# EAGLE design OfficeSign (EAGLE 8.7.1)
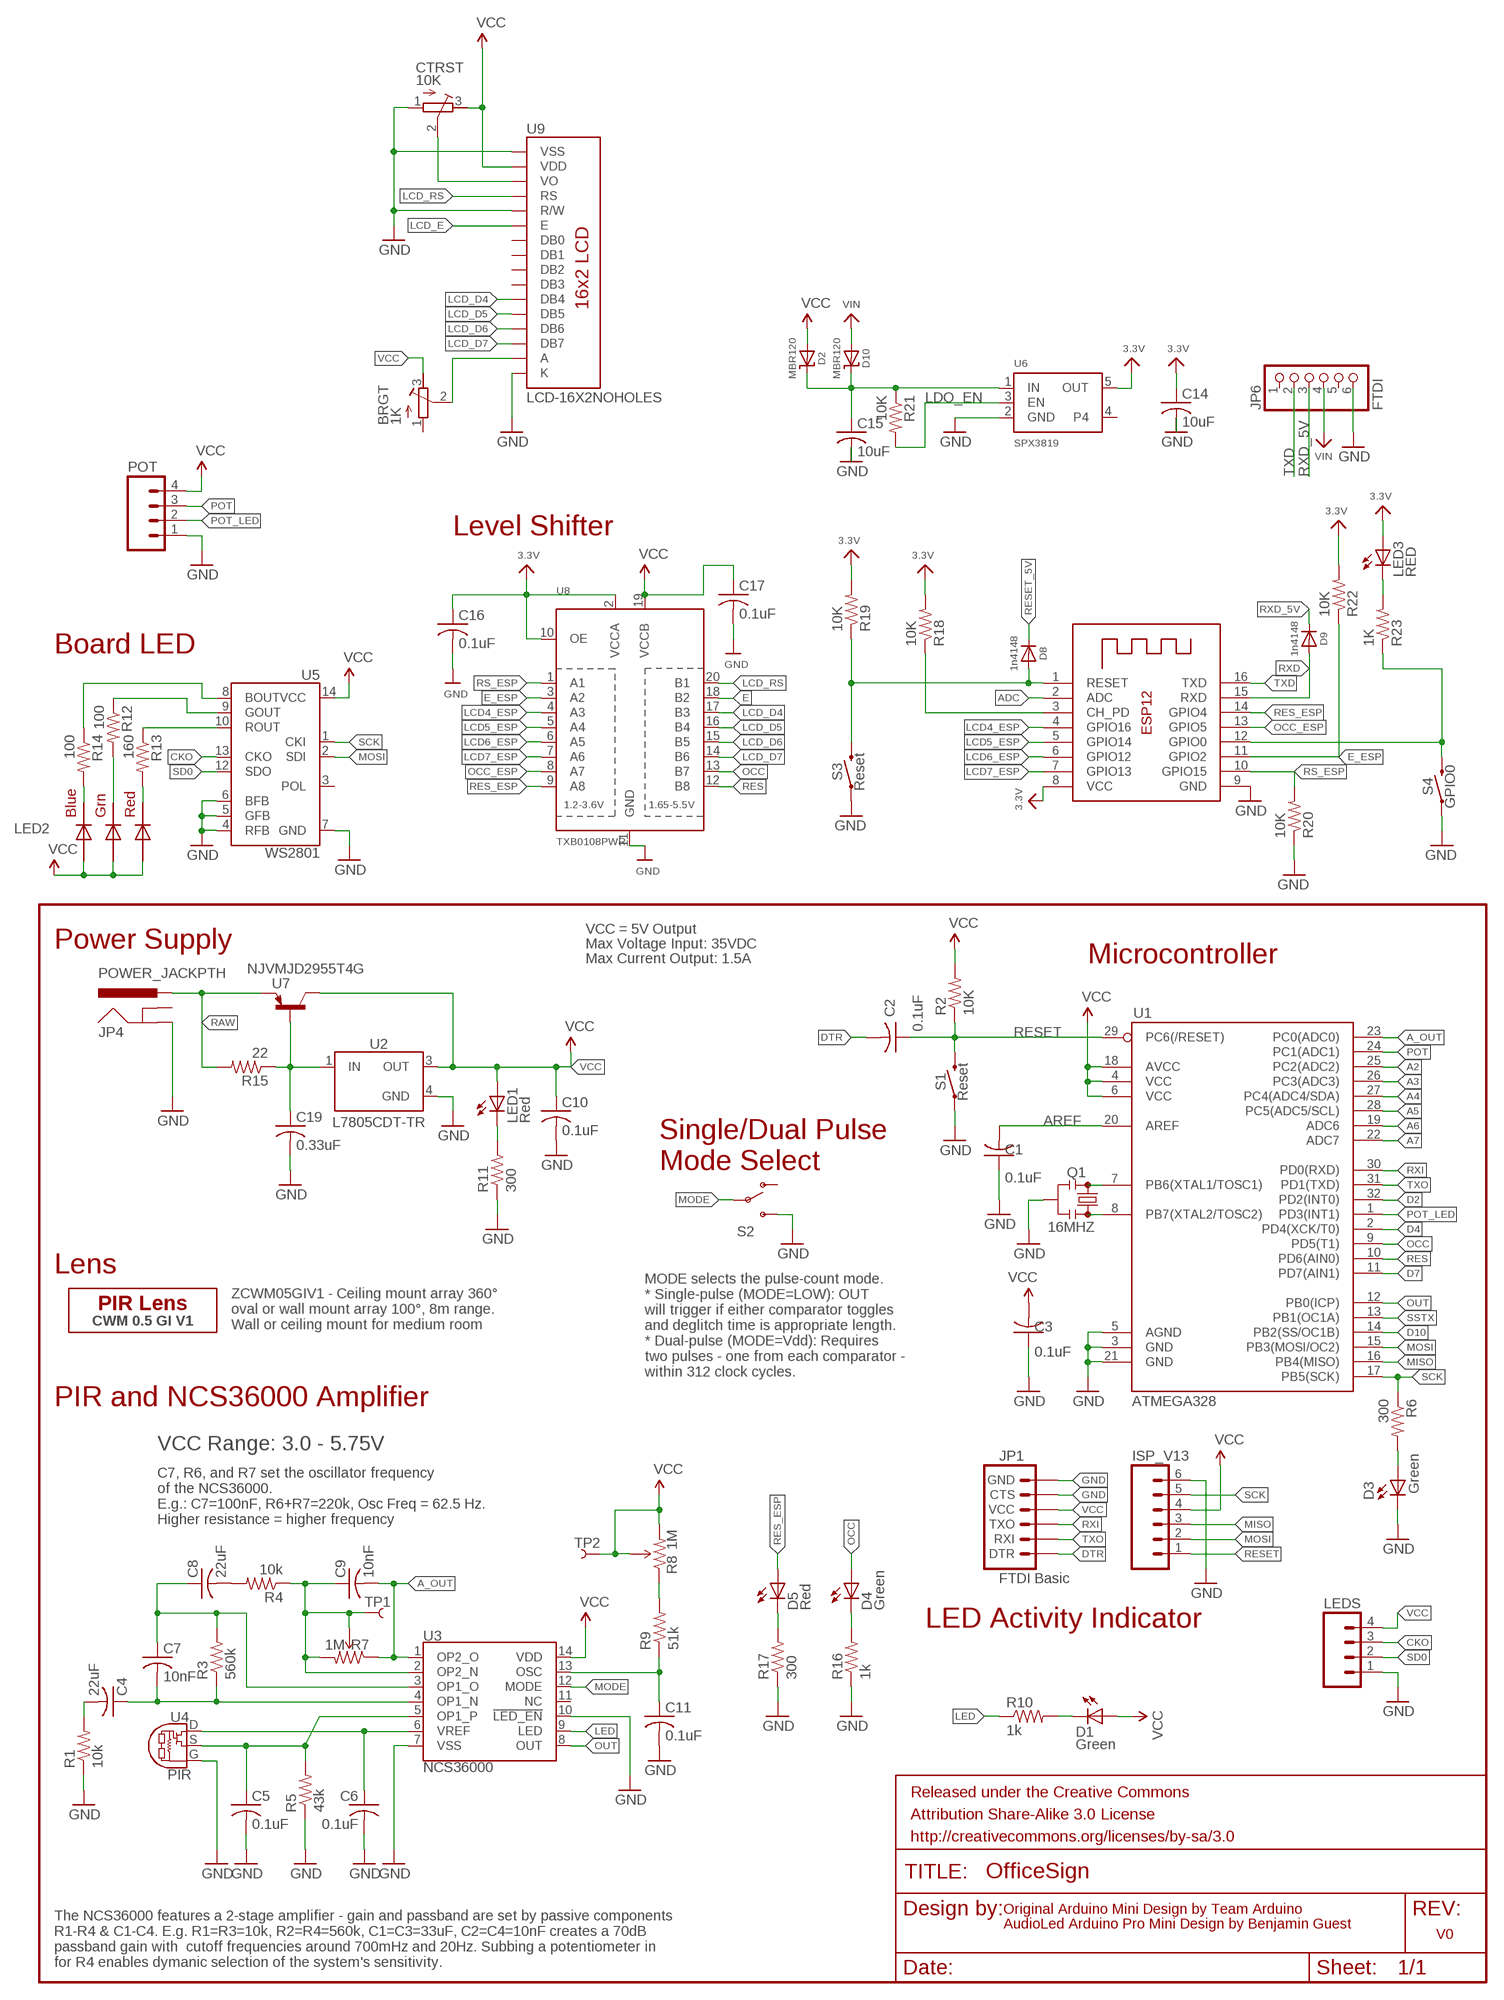
[diagram p0: schematic, sheet 1]

## Parts
BRGT  1K  R-TRIMM3296W  [RTRIM3296W]
C1  0.1uF  C-USC0805  [C0805]
C2  0.1uF  C-USC0805  [C0805]
C3  0.1uF  C-USC0805  [C0805]
C4  22uF  C-USC0805  [C0805]
C5  0.1uF  C-USC0805  [C0805]
C6  0.1uF  C-USC0805  [C0805]
C7  10nF  C-USC0805  [C0805]
C8  22uF  C-USC0805  [C0805]
C9  10nF  C-USC0805  [C0805]
C10  0.1uF  C-USC0805  [C0805]
C11  0.1uF  C-USC0805  [C0805]
C14  10uF  C-USC0805  [C0805]
C15  10uF  C-USC0805  [C0805]
C16  0.1uF  C-USC0805  [C0805]
C17  0.1uF  C-USC0805  [C0805]
C19  0.33uF  C-USC0805  [C0805]
CTRST  10K  R-TRIMM3296W  [RTRIM3296W]
D1  Green  LEDCHIPLED_0805  [CHIPLED_0805]
D2  MBR120  DIODE-SCHOTTKYSOD-123  [SOD-123]
D3  Green  LEDCHIPLED_0805  [CHIPLED_0805]
D4  Green  LEDCHIPLED_0805  [CHIPLED_0805]
D5  Red  LEDCHIPLED_0805  [CHIPLED_0805]
D8  1n4148  DIODESOD-323  [SOD-323]
D9  1n4148  DIODESOD-323  [SOD-323]
D10  MBR120  DIODE-SCHOTTKYSOD-123  [SOD-123]
FRAME1  FRAME-LETTER  [CREATIVE_COMMONS]
ISP_V13  M06SIP  [1X06]
JP1  FTDI Basic  ARDUINO_SERIAL_PROGRAMPTH  [1X06]
JP4  POWER_JACKPTH  [POWER_JACK_PTH]
JP6  FTDI  HEADER-1X670MIL  [1X06_ROUND_70]
LED1  Red  LEDCHIPLED_0805  [CHIPLED_0805]
LED2  RGBLED5050  [RGBLED5050]
LED3  RED  LEDCHIP-LED0805  [CHIP-LED0805]
LEDS  M04JST-PTH  [JST-4-PTH]
POT  M04JST-PTH  [JST-4-PTH]
Q1  16MHZ  RESONATOR16MHZ  [RESONATOR-SMD]
R1  10k  R-US_M0805  [M0805]
R2  10K  R-US_M0805  [M0805]
R3  560k  R-US_M0805  [M0805]
R4  10k  R-US_M0805  [M0805]
R5  43k  R-US_M0805  [M0805]
R6  300  R-US_M0805  [M0805]
R7  1M  TRIMPOTTX33X-1M  [TRIMPOT-TC33X]
R8  1M  TRIMPOTTX33X-1M  [TRIMPOT-TC33X]
R9  51k  R-US_M0805  [M0805]
R10  1k  R-US_M0805  [M0805]
R11  300  R-US_M0805  [M0805]
R12  100  R-US_M0805  [M0805]
R13  160  R-US_M0805  [M0805]
R14  100  R-US_M0805  [M0805]
R15  22  R-US_M0805  [M0805]
R16  1k  R-US_M0805  [M0805]
R17  300  R-US_M0805  [M0805]
R18  10K  R-US_M0805  [M0805]
R19  10K  R-US_M0805  [M0805]
R20  10K  R-US_M0805  [M0805]
R21  10K  R-US_M0805  [M0805]
R22  10K  R-US_M0805  [M0805]
R23  1K  R-US_M0805  [M0805]
S1  Reset  MOMENTARY-SWITCH-SPST-SMD-5.2-REDUNDANT  [TACTILE_SWITCH_SMD_5.2MM]
S2  SWITCH-SPDT-SMD-A  [SWITCH-SPST-SMD-A]
S3  Reset  MOMENTARY-SWITCH-SPST-SMD-5.2-REDUNDANT  [TACTILE_SWITCH_SMD_5.2MM]
S4  GPIO0  MOMENTARY-SWITCH-SPST-SMD-5.2-REDUNDANT  [TACTILE_SWITCH_SMD_5.2MM]
TP1  TEST-POINT3X5  [PAD.03X.05]
TP2  TEST-POINT3X5  [PAD.03X.05]
U1  ATMEGA328  ATMEGA168  [TQFP32-08]
U2  L7805CDT-TR  [DPAK]
U3  NCS36000  [SO14]
U4  PIR  [PIR]
U5  WS2801  [SOP-14]
U6  SPX3819  VREG_SOT23-5  [SOT23-5]
U7  NJVMJD2955T4G  [DPAK]
U8  TXB0108PWR  [TSSOP20]
U9  LCD-16X2NOHOLES  [LCD-16X2_NOHOLES]
U$1  CWM 0.5 GI V1  PIR-LENSCWM-0.5-GI-V1  [LENS-CWM-0.5-GI-V1]
X2  ESP-12  [ESP-12]

## Nets
3.3V: C14.1 C16.1 LED3.A R18.2 R19.2 R22.2 U6.5(OUT) U8.2(VCCA) U8.10(OE) X2.8(VCC)
A1: BRGT.2(S) U9.15(A)
A2: U1.25(PC2(ADC2))
A3: U1.26(PC3(ADC3))
A4: U1.27(PC4(ADC4/SDA))
A5: U1.28(PC5(ADC5/SCL))
A6: U1.19(ADC6)
A7: U1.22(ADC7)
A_OUT: C9.2 R7.1(CCW) U1.23(PC0(ADC0)) U3.1(OP2_O)
ADC: X2.2(ADC)
AREF: C1.2 U1.20(AREF)
CH_PD: R18.1 X2.3(CH_PD)
CKO: LEDS.3 U5.13(CKO)
D2: U1.32(PD2(INT0))
D4: U1.2(PD4(XCK/T0))
D7: U1.11(PD7(AIN1))
D10: U1.14(PB2(SS/OC1B))
DTR: C2.2 JP1.1(DTR)
E: U8.18(B2)
E_ESP: R22.1 U8.3(A2) X2.11(GPIO2)
GND [vcc]: C1.1 C3.1 C5.2 C6.2 C10.2 C11.2 C14.2 C15.2 C16.2 C17.2 C19.2 CTRST.1(A) D3.C ISP_V13.6 JP1.5(CTS) JP1.6(GND) JP4.GND JP6.6 LEDS.1 POT.1 Q1.2 R1.1 R5.1 R11.1 R16.1 R17.1 R20.1 S1.1 S1.2 S2.3(S) S3.1 S3.2 S4.1 S4.2 U1.3(GND) U1.5(AGND) U1.21(GND) U2.4(GND) U3.7(VSS) U3.10(!LED_EN!) U4.G U5.4(RFB) U5.5(GFB) U5.6(BFB) U5.7(GND) U6.2(GND) U8.11(GND) U9.1(VSS) U9.5(R/W) U9.16(K) X2.9(GND)
GPIO0: R23.1 S4.3 S4.4 X2.12(GPIO0)
L7805_IN [vcc]: C19.1 R15.1 U2.1(IN) U7.1(B)
LCD4_ESP: U8.4(A3) X2.4(GPIO16)
LCD5_ESP: U8.5(A4) X2.5(GPIO14)
LCD6_ESP: U8.6(A5) X2.6(GPIO12)
LCD7_ESP: U8.7(A6) X2.7(GPIO13)
LCD_D4: U8.17(B3) U9.11(DB4)
LCD_D5: U8.16(B4) U9.12(DB5)
LCD_D6: U8.15(B5) U9.13(DB6)
LCD_D7: U8.14(B6) U9.14(DB7)
LCD_E: U9.6(E)
LCD_RS: U8.20(B1) U9.4(RS)
LDO_EN: R21.2 U6.3(EN)
LED: R10.1 U3.9(LED)
MISO: ISP_V13.3 U1.16(PB4(MISO))
MODE: S2.2(P) U3.12(MODE)
MOSI: ISP_V13.2 U1.15(PB3(MOSI/OC2)) U5.2(SDI)
N$1: Q1.3 U1.8(PB7(XTAL2/TOSC2))
N$2: Q1.1 U1.7(PB6(XTAL1/TOSC1))
N$3: C6.1 U3.6(VREF) U4.D
N$4: LED1.C R11.2
N$5: C5.1 R5.2 U3.5(OP1_P) U4.S
N$6: C4.2 R1.2
N$7: D3.A R6.2
N$8: C8.2 R4.2
N$9: C4.1 C7.2 R3.1 U3.4(OP1_N)
N$10: C7.1 C8.1 R3.2 U3.3(OP1_O)
N$11: C9.1 R4.1 R7.2(WIPER) R7.3(CW) TP1.P$1 U3.2(OP2_N)
N$12: C11.1 R9.1 U3.13(OSC)
N$13: R8.1(CCW) R9.2
N$14: D1.C R10.2
N$15: R14.1 U5.8(BOUT)
N$16: R13.1 U5.10(ROUT)
N$17: LED3.C R23.2
N$18: D5.C R17.2
N$19: R12.1 U5.9(GOUT)
N$20: LED2.4(BLUE_C) R14.2
N$21: LED2.6(GREEN_C) R12.2
N$22: LED2.5(RED_C) R13.2
N$23: C15.1 D2.C D10.C R21.1 U6.1(IN)
N$24: D4.C R16.2
OCC: D4.A U1.9(PD5(T1)) U8.13(B7)
OCC_ESP: U8.8(A7) X2.13(GPIO5)
OUT: U1.12(PB0(ICP)) U3.8(OUT)
POT: POT.3 U1.24(PC1(ADC1))
POT_LED: POT.2 U1.1(PD3(INT1))
RAW [vcc]: JP4.PWR R15.2 U7.3(E)
RES: U1.10(PD6(AIN0)) U8.12(B8)
RES_ESP: D5.A U8.9(A8) X2.14(GPIO4)
RESET: C2.1 ISP_V13.1 R2.1 S1.3 S1.4 U1.29(PC6(/RESET))
RESET_5V: D8.C
RESET_HZA: D8.A R19.1 S3.3 S3.4 X2.1(RESET)
RS_ESP: R20.2 U8.1(A1) X2.10(GPIO15)
RXD: D9.A X2.15(RXD)
RXD_5V: D9.C JP6.3
RXI: JP1.3(TXO) U1.30(PD0(RXD))
SCK: ISP_V13.5 R6.1 U1.17(PB5(SCK)) U5.1(CKI)
SD0: LEDS.2 U5.12(SDO)
SSTX: U1.13(PB1(OC1A))
TXD: JP6.2 X2.16(TXD)
TXO: JP1.2(RXI) U1.31(PD1(TXD))
VCC [raw]: BRGT.3(E) C3.2 C10.1 C17.1 CTRST.3(E) D1.A D2.A ISP_V13.4 JP1.4(VCC) LED1.A LED2.1(GREEN_A) LED2.2(RED_A) LED2.3(BLUE_A) LEDS.4 POT.4 R2.2 R8.2(WIPER) R8.3(CW) TP2.P$1 U1.4(VCC) U1.6(VCC) U1.18(AVCC) U2.3(OUT) U3.14(VDD) U5.14(VCC) U7.4(C) U8.19(VCCB) U9.2(VDD)
VIN: D10.A JP6.4
VO: CTRST.2(S) U9.3(VO)
Unconnected: BRGT.1(A) JP4.GNDBREAK JP6.1 JP6.5 S2.1(O) U3.11(NC) U5.3(POL) U6.4 U9.7(DB0) U9.8(DB1) U9.9(DB2) U9.10(DB3)

## Notes on the sheet
- Level Shifter
- Board LED
- VCC = 5V Output
- Power Supply | Max Voltage Input: 35VDC
- Max Current Output: 1.5A | Microcontroller
- Single/Dual Pulse
  Mode Select
- Lens
- ZCWM05GIV1 - Ceiling mount array 360°
  oval or wall mount array 100°, 8m range.
  Wall or ceiling mount for medium room
- MODE selects the pulse-count mode.
  * Single-pulse (MODE=LOW): OUT 
  will trigger if either comparator toggles
  and deglitch time is appropriate length.
  * Dual-pulse (MODE=Vdd): Requires 
  two pulses - one from each comparator -
  within 312 clock cycles.
- PIR and NCS36000 Amplifier
- VCC Range: 3.0 - 5.75V
- C7, R6, and R7 set the oscillator frequency 
  of the NCS36000.
  E.g.: C7=100nF, R6+R7=220k, Osc Freq = 62.5 Hz.
  Higher resistance = higher frequency
- LED Activity Indicator
- Original Arduino Mini Design by Team Arduino
- AudioLed Arduino Pro Mini Design by Benjamin Guest
- V0
- The NCS36000 features a 2-stage amplifier - gain and passband are set by passive components
  R1-R4 & C1-C4. E.g. R1=R3=10k, R2=R4=560k, C1=C3=33uF, C2=C4=10nF creates a 70dB
  passband gain with  cutoff frequencies around 700mHz and 20Hz. Subbing a potentiometer in
  for R4 enables dymanic selection of the system's sensitivity.

## Library data of the parts
BRGT CTRST = resistor:R-TRIMM: Trimm resistor
C1-C11 C14 C15 C19 = adafruit:C-US: CAPACITOR, American symbol
C16 C17 = rcl:C-US: CAPACITOR, American symbol; SPICEPREFIX: C
D1 D3-D5 LED1 LED3 = led:LED: LED OSRAM: - CHIPLED LG R971, LG N971, LY N971, LG Q971, LY Q971, LO R971, LY R971 LH N974, LH R974 LS Q976, LO Q976, LY Q976 LO Q996 - Hyper CHIPLED LW Q18S LB Q993, LB Q99A, LB R99A - SideLED LS A670, LO A670, LY A670, LG A670, LP A670 LB A673, LV A673, LT A673, LW A673 LH A674 LY A675 LS A676, LA A676, LO A676, LY A676, LW A676 LS A679, LY A679, LG A679 - Hyper Micro SIDELED® LS Y876, LA Y876, LO Y876, LY Y876 LT Y87S - SmartLED LW L88C, LW L88S LB L89C, LB L89S, LG L890 LS L89K, LO L89K, LY L89K LS L896, LA L896, LO L896, LY L896 - TOPLED LS T670, LO T670, LY T670, LG T670, LP T670 LSG T670, LSP T670, LSY T670, LOP T670, LYG T670 LG T671, LOG T671, LSG T671 LB T673, LV T673, LT T673, LW T673 LH T674 LS T676, LA T676, LO T676, LY T676, LB T676, LH T676, LSB T676, LW T676 LB T67C, LV T67C, LT T67C, LS T67K, LO T67K, LY T67K, LW E67C LS E67B, LA E67B, LO E67B, LY E67B, LB E67C, LV E67C, LT E67C LW T67C LS T679, LY T679, LG T679 LS T770, LO T770, LY T770, LG T770, LP T770 LB T773, LV T773, LT T773, LW T773 LH T774 LS E675, LA E675, LY E675, LS T675 LS T776, LA T776, LO T776, LY T776, LB T776 LHGB T686 LT T68C, LB T68C - Hyper Mini TOPLED® LB M676 - Mini TOPLED Santana® LG M470 LS M47K, LO M47K, LY M47K Source: http://www.osram.convergy.de LUXEON: - LUMILED® LXK2-PW12-R00, LXK2-PW12-S00, LXK2-PW14-U00, LXK2-PW14-V00 LXK2-PM12-R00, LXK2-PM12-S00, LXK2-PM14-U00 LXK2-PE12-Q00, LXK2-PE12-R00, LXK2-PE12-S00, LXK2-PE14-T00, LXK2-PE14-U00 LXK2-PB12-K00, LXK2-PB12-L00, LXK2-PB12-M00, LXK2-PB14-N00, LXK2-PB14-P00, LXK2-PB14-Q00 LXK2-PR12-L00, LXK2-PR12-M00, LXK2-PR14-Q00, LXK2-PR14-R00 LXK2-PD12-Q00, LXK2-PD12-R00, LXK2-PD12-S00 LXK2-PH12-R00, LXK2-PH12-S00 LXK2-PL12-P00, LXK2-PL12-Q00, LXK2-PL12-R00 Source: www.luxeon.com KINGBRIGHT: KA-3528ASYC Source: www.kingbright.com
D2 D10 = microbuilder:DIODE-SCHOTTKY
D8 D9 = microbuilder:DIODE: Diode SMA Model Volts Amps Type Vf Ir Digikey # Notes SSA34-E3 40V 3A Schottky 480mV @ 3A 200uA @ 40V SSA34-E3/61TGITR-ND CDBA120-G 20V 1A Schottky 500mV @ 1A 500uA @ 20V 641-1014-6-ND REEL MBRA210 10V 2A Schottky 350mV @ 2A 700uA @ 10V MBRA210LT3 SOD-123 Model Volts Amps Type Vf Ir Order # Notes BAT54T1G 30V 200mA Schottky 800mV @ 200mA 2uA @ 25V BAT54T1GOSTR-ND B0530W 30V 500mA Schottky 430mV @ 500mA 130uA @ 30V B0530W-FDICT-ND REEL MBR120 20V 1A Schottky 340mV @ 1A MBR120VLSFT1GOSCT-ND SOD-323 Model Volts Amps Type Vf Ir Order # Notes PMEG2005EJ 20V 500mA Schottky 355mV @ 500mA 568-4110-1-ND ZLLS410 10V 570mA Schottky 380mV @ 570mA ZLLS410CT-ND 1N4148WS 75V 150mA Silicon/Simple 1V 1N4148WSFSCT-ND REEL SOD-523 Model Volts Amps Type Vf Ir Order # Notes BAT54XV2 30V 200mA Schottky 0.8V @ 100mA BAT54XV2CT-ND TB751S 30V 30mA Schottky RB751S-40TE61CT-ND SOT23-R/W (R = Solder Paste/Reflow Ovens, W = Hand-Soldering) Model Volts Amps Type Vf Ir Order # Notes BAT54FILM 40V 300mA Schottky 497-7162-1-ND POWERDI-5 Model Volts Amps Type Vf Ir Order # Notes PDS560 60V 5A Schottky 670mV @ 5A 150uA @ 60V PDS560DICT-ND
FRAME1 = SparkFun-Aesthetics:FRAME-LETTER: Schematic Frame Standard 8.5x11 US Letter frame
ISP_V13 = SparkFun-Connectors:M06: Header 6 Standard 6-pin 0.1" header. Use with straight break away headers (SKU : PRT-00116), right angle break away headers (PRT-00553), swiss pins (PRT-00743), machine pins (PRT-00117), and female headers (PRT-00115). Molex polarized connector foot print use with SKU : PRT-08094 with associated crimp pins and housings. NOTES ON THE VARIANTS LOCK and LOCK_LONGPADS... This footprint was designed to help hold the alignment of a through-hole component (i.e. 6-pin header) while soldering it into place. You may notice that each hole has been shifted either up or down by 0.005 of an inch from it's more standard position (which is a perfectly straight line). This slight alteration caused the pins (the squares in the middle) to touch the edges of the holes. Because they are alternating, it causes a "brace" to hold the component in place. 0.005 has proven to be the perfect amount of "off-center" position when using our standard breakaway headers. Although looks a little odd when you look at the bare footprint, once you have a header in there, the alteration is very hard to notice. Also, if you push a header all the way into place, it is covered up entirely on the bottom side. This idea of altering the position of holes to aid alignment will be further integrated into the Sparkfun Library for other footprints. It can help hold any component with 3 or more connection pins.
JP1 = SparkFun:ARDUINO_SERIAL_PROGRAM
JP4 = SparkFun-Connectors:POWER_JACK: Power Jack This is the standard 5.5mm barrel jack for power. The PTH is the most common, proven, reliable, footprint. The Slot footprint only works if the mill layer is transmitted to the PCB fab house so be warned. Mating wall wart : TOL-00298 (and others); PROD_ID: CONN-08197
JP6 = microbuilder:HEADER-1X6: PIN HEADER
LED2 = adafruit:RGBLED: For 5050 RGB LEDs, the order of the LEDs may vary from one manufacturer to another!
LEDS POT = SparkFun-Connectors:M04: Header 4 Standard 4-pin 0.1" header. Use with straight break away headers (SKU : PRT-00116), right angle break away headers (PRT-00553), swiss pins (PRT-00743), machine pins (PRT-00117), and female headers (PRT-00115). Molex polarized connector foot print use with SKU : PRT-08231 with associated crimp pins and housings. 1MM SMD Version SKU: PRT-10208; SKU: PRT-09916
Q1 = SparkFun-FreqCtrl:RESONATOR: Resonator Small SMD resonator. Used, eg, on the Arduino Pro/ Pro Mini boards. 8MHz- XTAL-08895 16MHz- XTAL-08900; PROD_ID: XTAL-08900
R1-R6 R9-R23 = adafruit:R-US_: RESISTOR, American symbol
R7 R8 = openPIR-temp:TRIMPOT: Various small potentiometers for "set-and-forget" applications; PROD_ID: RES-13431
S1 S3 S4 = SparkFun-Switches:MOMENTARY-SWITCH-SPST: Momentary Switch (Pushbutton) - SPST Normally-open (NO) SPST momentary switches (buttons, pushbuttons). Variants PTH-12MM - 12mm square, through-hole Momentary Pushbutton Switch - 12mm Square <https://www.sparkfun.com/products/9190> (COM-09190) PTH-6.0MM, PTH-6.0MM-KIT - 6.0mm square, through-hole Mini Pushbutton Switch <https://www.sparkfun.com/products/97> (COM-00097) KIT package intended for soldering kit's - only one side of pads' copper is exposed. PTH-RIGHT-ANGLE-KIT - Right-angle, through-hole Right Angle Tactile Button <https://www.sparkfun.com/products/10791> - Used on SparkFun BigTime Watch Kit <https://www.sparkfun.com/products/11734> SMD-12MM - 12mm square, surface-mount Tactile Button - SMD (12mm) <https://www.sparkfun.com/products/12993> (COM-12993) Used on SparkFun PicoBoard <https://www.sparkfun.com/products/11888> SMD-4.5MM - 4.5mm Square Trackball Switch Used on SparkFun Blackberry Trackballer Breakout <https://www.sparkfun.com/products/13169> SMD-4.6MMX2.8MM - 4.60mm x 2.80mm, surface mount Used on SparkFun SAMD21 Mini Breakout <https://www.sparkfun.com/products/13664> SMD-5.2MM, SMD-5.2-REDUNDANT - 5.2mm square, surface-mount Mini Pushbutton Switch - SMD <https://www.sparkfun.com/products/8720> (COM-08720) Used on Arduino Pro Mini <https://www.sparkfun.com/products/11114> REDUNDANT package connects both switch circuits together SMD-6.0X3.5MM - 6.0 x 3.5mm, surface mount Momentary Reset Switch SMD <https://www.sparkfun.com/products/8229> (COM-08229) SMD-6.2MM-TALL - 6.2mm square, surface mount Tactile Button - SMD (6mm) <https://www.sparkfun.com/products/12992> Used on SparkFun Digital Sandbox <https://www.sparkfun.com/products/12651> SMD-RIGHT-ANGLE - Right-angle, surface mount Used on SparkFun Block for Intel® Edison - Arduino <https://www.sparkfun.com/products/13036>; PROD_ID: SWCH-08247; SF_SKU: COM-08720
S2 = SparkFun-Electromechanical:SWITCH-SPDT: SPDT Switch Simple slide switch, Spark Fun Electronics SKU : COM-00102 DPDT SMT slide switch, AYZ0202, SWCH-08179; PROD_ID: SWCH-10651
TP1 TP2 = SparkFun-Connectors:TEST-POINT: Bare copper test points for troubleshooting or ICT
U1 = SparkFun:ATMEGA168
U2 = BAG:L7805CDT-TR: Description The L78 series of three-terminal positive regulators is available in TO-220, TO-220FP, D²PAK and DPAK packages and several fixed output voltages, making it useful in a wide range of applications. These regulators can provide local on-card regulation, eliminating the distribution problems associated with single point regulation. Each type embeds internal current limiting, thermal shutdown and safe area protection, making it essentially indestructible. If adequate heat sinking is provided, they can deliver over 1 A output current. Although designed primarily as fixed voltage regulators, these devices can be used with external components to obtain adjustable voltage and currents.
U3 = openPIR-temp:NCS36000; PROD_ID: IC-13432
U4 = openPIR-temp:PIR; PROD_ID: IC-13430
U5 = SparkFun-DigitalIC:WS2801: WS2801 3 Channel Constant Current LED Driver with programmable PWM outputs. Datasheet: http://www.sparkfun.com/datasheets/Components/LED/WS2801.pdf
U6 = microbuilder:VREG_SOT23-5: SOT23-5 Fixed Voltage Regulators Part Current Out V Out V In V Dropout θJA (°C/W) TJ (°C) Digikey Part No. ADP121 150mA 3.3V 3.4-5.5V 0.09V @ 150mA -- -- ADP121-AUJZ33R7CT-ND ADP121 150mA 3.0V 3.1-5.5V 0.09V @ 150mA -- -- ADP121-AUJZ30R7CT-ND ADP122 300mA 3.3V 3.4-5.5V 0.085V @ 300mA -- -- ADP122AUJZ-3.3-R7CT-ND ADP1712 300mA 3.3V 3.5-5.5V 0.17V @ 300mA -- -- ADP1712AUJZ-3.3-R7TR-ND AP7311 (Low Cost) 150mA 3.3V 3.5-6V 0.15V @ 150mA -- -- AP7311-33WG-7DICT-ND LD39015M18R 150mA 1.8V 1.9V-5.5V 0.08V @ 100mA -- -- 497-6977-1-ND LP2985A-33DBVR 150mA 3.3V 3.3-16V 0.28V @ 150mA 206 150 296-18479-1-ND MCP1824T-3302E/OT 300mA 3.3V 3.5V-6V 0.2V @ 300mA -- -- MCP1824T-3302E/OTCT-ND MIC5205-2.5YM5 TR 150mA 2.5V 2.7-16V 0.165V @ 150mA -- -- 576-1257-2-ND MIC5205-3.0YM5 TR 150mA 3.0V 3.2V-16V 0.165V @ 150mA -- -- 576-1258-2-ND MIC5205-3.3YM5 TR 150mA 3.3V 3.5V-16V 0.165V @ 150mA -- -- 576-1259-2-ND TPS780330220 150mA 3.3V+2.2V 3.6-5.5V 250mV Max -- -- 296-23332-1-ND TDA3663/N1,135 100mA 3.3V 3.5-45V 0.18V @ 50mA -- -- 568-5343-1-ND Max operating temp can be calculated using θJA, TJ (max junction temperature), and power in watts. Set the "Maximum Ambient Temperature" until it reaches TJ ("Max Junction Temperature"), which is the absolute limit for safe use of the regulator: Heat Sink Temperature Calculator <http://www.daycounter.com/Calculators/Heat-Sink-Temperature-Calculator.phtml> For example, With 12V source into a 3.3V LP2985 and a 30mA load, we are dissipating (12V-3.3V) * 0.03A = 0.261W. With a θJA of 206 °C/W, a TJ of 150°C, and 261mW we can safely use the chip without a heat sink up to 75°C (=147.1°C Junction Temperature).
U7 = bg_eagle_lib:NJVMJD2955T4G
U8 = microbuilder:TXB0108PWR: 8-Bit Bi-Directional Level Shifter 1.2V-3.6V (VCCA) to 1.65V-5.5V (VCCB) bi-directional level shifter with auto direction sensing. Max data rate - VCCA 1.8V: 20Mbps (50ns), VCCA 3.3V: 100Mbps (10ns) Digikey: 296-21527-1-ND
U9 = SparkFun-Displays:LCD-16X2: Standard text-only 16x2 parallel input LCD
U$1 = openPIR-temp:PIR-LENS
X2 = microbuilder:ESP-12

## Net classes
0 default: width 0.254 mm, drill 0.381 mm, clearance 0.254 mm
1 vcc: width 0.508 mm, drill 0.381 mm, clearance 0.254 mm
2 raw: width 0.508 mm, drill 0.381 mm, clearance 0.254 mm

## Board
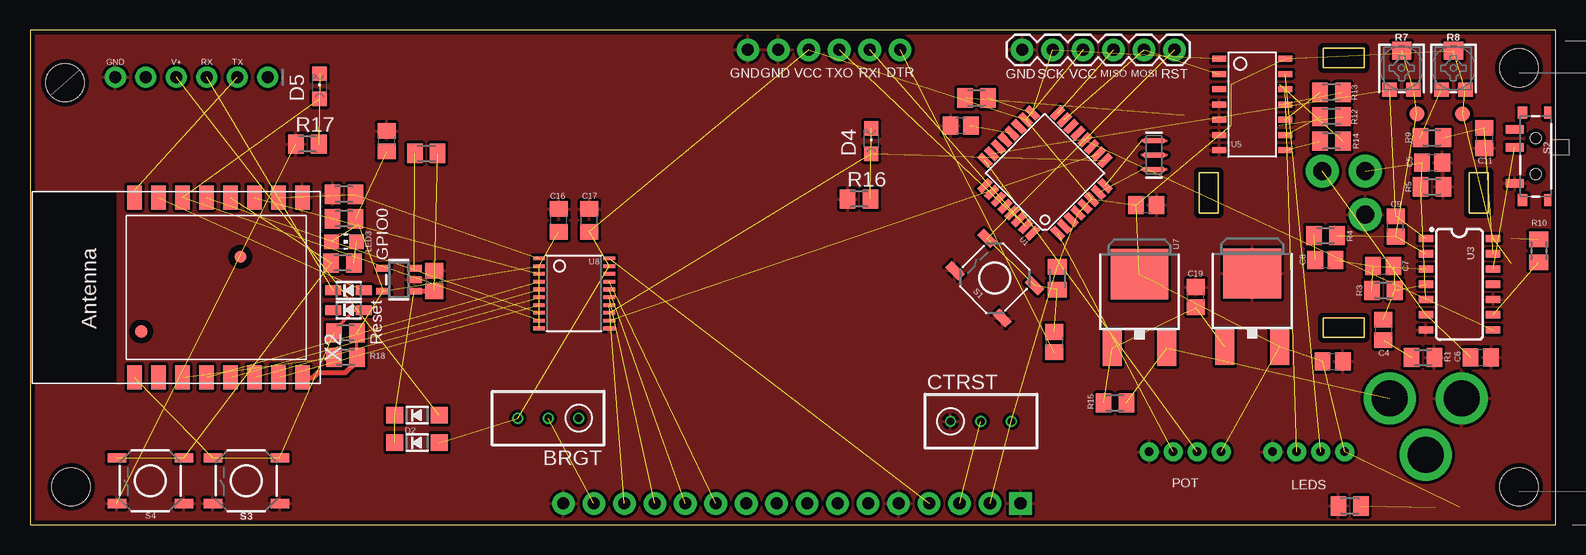
[diagram p1: board, top side]
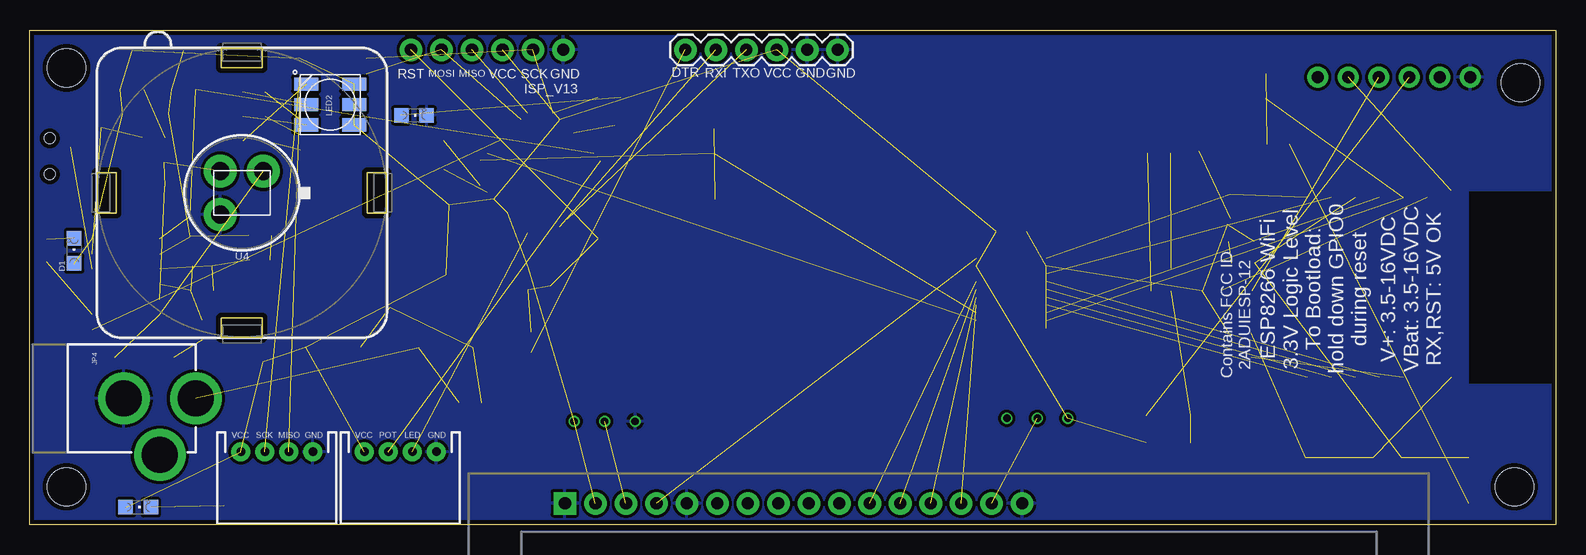
[diagram p2: board, bottom side, seen from below]

Size 127.13 x 41.27 mm. Coordinates in mm from the lower left corner, seen from the top.
Outline: 7.87,0 28.19,0
Outline: 0,41.27 0,0 127.13,0 127.13,41.27 0,41.27
Copper layers (1*16): Top 0.035559375mm / dielectric 1.6mm / Bottom 0.035559375mm
Design rules "oshpark-2layer-auto-routing": minimum track width 10mil, minimum drill 10mil, track to track 10mil, track to pad 8mil, pad to pad 8mil, via to via 8mil, smd to smd 6mil, copper to edge 15mil, drill to drill 6mil, minimum pad ring 6mil, minimum via ring 6mil, stop-mask expansion 2.5mil, vias tented up to drill 0mil, thermal gap 10mil
Holes 3.17 mm at 124.08,3.17 3.43,3.17 2.92,36.88 124.08,38.1

### Footprints (pad centres in the part's own frame; a part is rotated, then mirrored left to right if it is on the bottom)
RTRIM3296W = drill 0.61: 1 0,-2.54; 2 0,0; 3 0,2.54
C0805 = smd 1.3 x 1.5: 1 -0.85,0; 2 0.85,0
C0805' = smd 1.3 x 1.5: 1 -0.95,0; 2 0.95,0
CHIPLED_0805 = smd 1.2 x 1.2: A 0,-1.05; C 0,1.05
SOD-123 = smd 1.4 x 1.4: A 1.85,0; C -1.85,0
SOD-323 = smd 1.35 x 0.8: A 1.27,0; C -1.27,0
FIDUCIAL_1MM = smd 1 x 1: 1 0,0
1X06 = drill 1.016 pad 1.88: 1 0,0; 2 2.54,0; 3 5.08,0; 4 7.62,0; 5 10.16,0; 6 12.7,0
POWER_JACK_PTH = drill 2.997 pad 4.318: GND 0,7.7; GNDBREAK 4.7,10.7; PWR 0,13.7
1X06_ROUND_70 = drill 1 pad 1.778: 1 -6.35,0; 2 -3.81,0; 3 -1.27,0; 4 1.27,0; 5 3.81,0; 6 6.35,0
RGBLED5050 = smd 2 x 1.1: 1 -2,1.7; 2 -2,0; 3 -2,-1.7; 4 2,-1.7; 5 2,0; 6 2,1.7
CHIP-LED0805 = smd 1.2 x 1.2: A 0,-1.05; C 0,1.05
JST-4-PTH = drill 0.7 pad 1.6: 1 -3,0; 2 -1,0; 3 1,0; 4 3,0
RESONATOR-SMD = smd 0.45 x 1.905: 1 -1.2,0; 2 0,0; 3 1.2,0
M0805 = smd 1.3 x 1.6: 1 -0.95,0; 2 0.95,0
TRIMPOT-TC33X = smd 1.2 x 1.2: 1 -1,-1.8; 3 1,-1.8 | smd 1.6 x 1.5: 2 0,1.45
TACTILE_SWITCH_SMD_5.2MM = smd 1.524 x 0.762: 1 -2.794,1.905; 2 2.794,1.905; 3 -2.794,-1.905; 4 2.794,-1.905
SWITCH-SPST-SMD-A = smd 0.7 x 1.5: 1 -2.25,-1.75; 2 -0.75,-1.75; 3 2.25,-1.75 | smd 1 x 0.6: GND1 -3.65,1; GND3 3.65,1 | smd 1 x 0.8: GND2 -3.65,-1.1; GND4 3.65,-1.1 | hole 0.9: -1.5,0; 1.5,0
PAD.03X.05 = smd 1.27 x 1.27: P$1 0,0
TQFP32-08 = smd 1.27 x 0.559: 1 -4.293,2.8; 2 -4.293,2; 3 -4.293,1.2; 4 -4.293,0.4; 5 -4.293,-0.4; 6 -4.293,-1.2; 7 -4.293,-2; 8 -4.293,-2.8; 17 4.293,-2.8; 18 4.293,-2; 19 4.293,-1.2; 20 4.293,-0.4; 21 4.293,0.4; 22 4.293,1.2; 23 4.293,2; 24 4.293,2.8 | smd 0.559 x 1.27: 9 -2.8,-4.293; 10 -2,-4.293; 11 -1.2,-4.293; 12 -0.4,-4.293; 13 0.4,-4.293; 14 1.2,-4.293; 15 2,-4.293; 16 2.8,-4.293; 25 2.8,4.293; 26 2,4.293; 27 1.2,4.293; 28 0.4,4.293; 29 -0.4,4.293; 30 -1.2,4.293; 31 -2,4.293; 32 -2.8,4.293
DPAK = smd 1.6 x 3: 1 -2.28,-4.04; 3 2.28,-4.04 | smd 4.826 x 4.191: 4 0,2.096
SO14 = smd 0.6 x 1.2: 1 -3.81,-2.8; 2 -2.54,-2.8; 3 -1.27,-2.8; 4 0,-2.8; 5 1.27,-2.8; 6 2.54,-2.8; 7 3.81,-2.8; 8 3.81,2.8; 9 2.54,2.8; 10 1.27,2.8; 11 0,2.8; 12 -1.27,2.8; 13 -2.54,2.8; 14 -3.81,2.8
PIR = drill 1.5 pad 2.75: D -1.8,-1.8; G 1.8,1.8; S 1.8,-1.8
SOP-14 = smd 0.5 x 1.2: 1 -3.81,-2.75; 2 -2.54,-2.75; 3 -1.27,-2.75; 4 0,-2.75; 5 1.27,-2.75; 6 2.54,-2.75; 7 3.81,-2.75; 8 3.81,2.75; 9 2.54,2.75; 10 1.27,2.75; 11 0,2.75; 12 -1.27,2.75; 13 -2.54,2.75; 14 -3.81,2.75
SOT23-5 = smd 0.55 x 1.2: 1 -0.95,-1.3; 2 0,-1.3; 3 0.95,-1.3; 4 0.95,1.3; 5 -0.95,1.3
TSSOP20 = smd 0.305 x 0.991: 1 -2.925,-2.918; 2 -2.275,-2.918; 3 -1.625,-2.918; 4 -0.975,-2.918; 5 -0.325,-2.918; 6 0.325,-2.918; 7 0.975,-2.918; 8 1.625,-2.918; 9 2.275,-2.918; 10 2.925,-2.918; 11 2.925,2.918; 12 2.275,2.918; 13 1.625,2.918; 14 0.975,2.918; 15 0.325,2.918; 16 -0.325,2.918; 17 -0.975,2.918; 18 -1.625,2.918; 19 -2.275,2.918; 20 -2.925,2.918
LCD-16X2_NOHOLES = drill 1.016 pad 1.88 square: 1 -32,15.5 | drill 1.016 pad 1.88: 2 -29.46,15.5; 3 -26.92,15.5; 4 -24.38,15.5; 5 -21.84,15.5; 6 -19.3,15.5; 7 -16.76,15.5; 8 -14.22,15.5; 9 -11.68,15.5; 10 -9.14,15.5; 11 -6.6,15.5; 12 -4.06,15.5; 13 -1.52,15.5; 14 1.02,15.5; 15 3.56,15.5; 16 6.1,15.5
ESP-12 = smd 2 x 1.2: 1 -7.5,4.5; 2 -7.5,2.5; 3 -7.5,0.5; 4 -7.5,-1.5; 5 -7.5,-3.5; 6 -7.5,-5.5; 7 -7.5,-7.5; 8 -7.5,-9.5; 9 7.5,-9.5; 10 7.5,-7.5; 11 7.5,-5.5; 12 7.5,-3.5; 13 7.5,-1.5; 14 7.5,0.5; 15 7.5,2.5; 16 7.5,4.5

### Placement (x,y rotation side)
BRGT  43.18,8.89 90 top
C1  77.56,33.31 0 top
C2  85.34,15.24 270 top
C3  93.03,26.67 180 top
C4  112.78,16.26 270 top
C5  116.84,30.23 0 top
C6  120.9,13.97 0 top
C7  112.78,21.59 0 top
C8  107.95,22.1 180 top
C9  113.79,24.89 90 top
C10  108.56,13.64 0 top
C11  121.18,32.27 270 top
C14  29.72,32 90 top
C15  33.71,20.35 90 top
C16  0.1uF  [C0805']  44.07,25.4 90 top
C17  0.1uF  [C0805']  46.61,25.4 90 top
C19  97.16,18.99 90 top
CTRST  79.25,8.64 270 top
D1  123.44,22.86 0 bottom
D2  32.26,6.86 0 top
D3  95.12,34.15 270 bottom
D4  70.1,32 0 top
D5  24.13,36.58 0 top
D8  26.54,17.91 0 top
D9  26.54,19.56 0 top
D10  32.26,9.14 0 top
FID2  FIDUCIAL""  [FIDUCIAL_1MM]  9.27,16.13 90 top
FID4  FIDUCIAL""  [FIDUCIAL_1MM]  17.53,22.35 90 top
FRAME1  48.53,-53.34 0 top  (outside the outline)
ISP_V13  95.38,39.62 180 top
JP1  72.52,39.62 0 bottom
JP4  127,10.54 270 bottom
JP6  13.46,37.34 180 top
LED1  118.11,1.47 270 bottom
LED2  102.11,35.05 180 bottom
LED3  26.16,23.62 270 top
LEDS  106.55,6.1 180 bottom
POT  96.27,6.1 180 bottom
Q1  93.68,30.84 90 top
R1  116.08,13.97 180 top
R2  85.6,20.57 90 top
R3  112.78,19.56 180 top
R4  107.95,24.13 180 top
R5  116.84,28.19 180 top
R6  78.87,35.61 180 top
R7  114.3,38.1 0 top
R8  118.62,38.1 0 top
R9  116.82,32.28 180 top
R10  125.73,22.86 90 top
R11  109.98,1.57 0 top
R12  108.46,34.04 0 top
R13  108.46,36.07 0 top
R14  108.46,32 0 top
R15  90.42,10.16 0 top
R16  69.09,27.18 0 top
R17  23.11,31.75 0 top
R18  26.29,13.97 0 top
R19  26.29,16 0 top
R20  26.16,27.56 0 top
R21  33.02,30.99 180 top
R22  26.16,25.53 0 top
R23  26.04,21.84 0 top
S1  80.39,20.57 135 top
S2  125.48,30.73 270 top
S3  18.03,3.68 180 top
S4  10.03,3.68 180 top
TP1  115.57,34.29 0 top
TP2  119.38,34.29 0 top
U1  84.58,29.34 135 top
U2  101.85,18.86 0 top
U3  119.13,20.07 270 top
U4  109.47,27.69 180 bottom
U5  101.85,35.05 270 top
U6  30.73,20.45 90 top
U7  92.46,18.8 0 top
U8  45.34,19.3 270 top
U9  50.55,-13.72 0 bottom
U$1  109.47,27.69 0 bottom
U$34  [HUZZAHLOGO]  7.75,28.7 270 bottom
X2  13.21,19.81 90 top

### Tracks (layer width: path | path; a pad name or v marks a point on that pad's centre or on a via)
3.3V  (7 unrouted)
  Top 0.254: 27.34,25.05 R22.2 | R19.2 R18.2 27.18,13.91
  Top 0.406: X2.8 23.62,12.31 24,12.7 26.29,12.7 27.05,13.46 27.05,13.78 R18.2
A1  (1 unrouted)
A_OUT  (3 unrouted)
AREF  (1 unrouted)
CH_PD  (1 unrouted)
CKO  (1 unrouted)
DTR  (1 unrouted)
E_ESP  (2 unrouted)
GND  (1 unrouted)
  pour Top: -0.25,41.66 -0.51,-0.25 127.38,-0.25 127.64,41.66
  pour Bottom: -0.51,42.16 -0.76,-0.51 127.64,-0.51 127.89,42.16
GPIO0  (3 unrouted)
L7805_IN  (3 unrouted)
LCD4_ESP  (1 unrouted)
LCD5_ESP  (1 unrouted)
  Top 0.305: 16.71,11.49 X2.5
LCD6_ESP  (1 unrouted)
  Top 0.305: 18.71,12.03 X2.6
LCD7_ESP  (1 unrouted)
LCD_D4  (1 unrouted)
LCD_D5  (1 unrouted)
LCD_D6  (1 unrouted)
LCD_D7  (1 unrouted)
LCD_RS  (1 unrouted)
LDO_EN  (1 unrouted)
LED  (1 unrouted)
MISO  (1 unrouted)
MODE  (1 unrouted)
MOSI  (2 unrouted)
N$1  (1 unrouted)
N$2  (1 unrouted)
N$3  (2 unrouted)
N$4  (1 unrouted)
N$5  (3 unrouted)
N$6  (1 unrouted)
N$7  (1 unrouted)
N$8  (1 unrouted)
N$9  (3 unrouted)
N$10  (3 unrouted)
N$11  (5 unrouted)
N$12  (2 unrouted)
N$13  (1 unrouted)
N$14  (1 unrouted)
N$15  (1 unrouted)
N$16  (1 unrouted)
N$17  (1 unrouted)
N$18  (1 unrouted)
N$19  (1 unrouted)
N$20  (1 unrouted)
N$21  (1 unrouted)
N$22  (1 unrouted)
N$23  (3 unrouted)
  Top 0.406: U6.1 C15.1
N$24  (1 unrouted)
OCC  (2 unrouted)
OCC_ESP  (1 unrouted)
OUT  (1 unrouted)
POT  (1 unrouted)
POT_LED  (1 unrouted)
RAW  (2 unrouted)
RES  (1 unrouted)
RES_ESP  (2 unrouted)
RESET  (5 unrouted)
RESET_HZA  (3 unrouted)
  Top 0.305: D8.A 27.05,17.91 25.34,16.2 R19.1
RS_ESP  (2 unrouted)
RXD  (1 unrouted)
RXD_5V  (1 unrouted)
RXI  (1 unrouted)
SCK  (3 unrouted)
SD0  (1 unrouted)
TXD  (1 unrouted)
  Top 0.305: 8.38,27.64 X2.16 8.71,27.87
TXO  (1 unrouted)
VCC  (27 unrouted)
VIN  (1 unrouted)
VO  (1 unrouted)

### Text on the board
tPlace: GND | V+ | RX | TX | GND | VCC | TXO | RXI | GND | DTR | GND | SCK | VCC | MISO | MOSI | RST | GPIO0 | Reset
bPlace: GND | VCC | TXO | RXI | GND | DTR | GND | SCK | VCC | MISO | MOSI | RST | V+: 3.5-16VDC / VBat: 3.5-16VDC / RX,RST: 5V OK | ESP8266 WiFi / 3.3V Logic Level / To Bootload: / hold down GPIO0 / during reset | Contains FCC ID / 2ADUIESP-12 | GND | LED | POT | VCC | GND | MISO | SCK | VCC
Document: Valid combinations: | 168V / 3.3V Reg / 8MHz | 168 / 5V Reg / 16MHz | 168 / 5V Reg / 20MHz | Mark back accordingly
tDocu: Original Arduino Mini Design by Team Arduino / Arduino Pro Mini Design by SparkFun Electronics / Revised by Pete Lewis, OfficeSensor by Benjamin Guest
bDocu: VCC: 9-12V | LED MAX: 1.5A | POT | LEDS